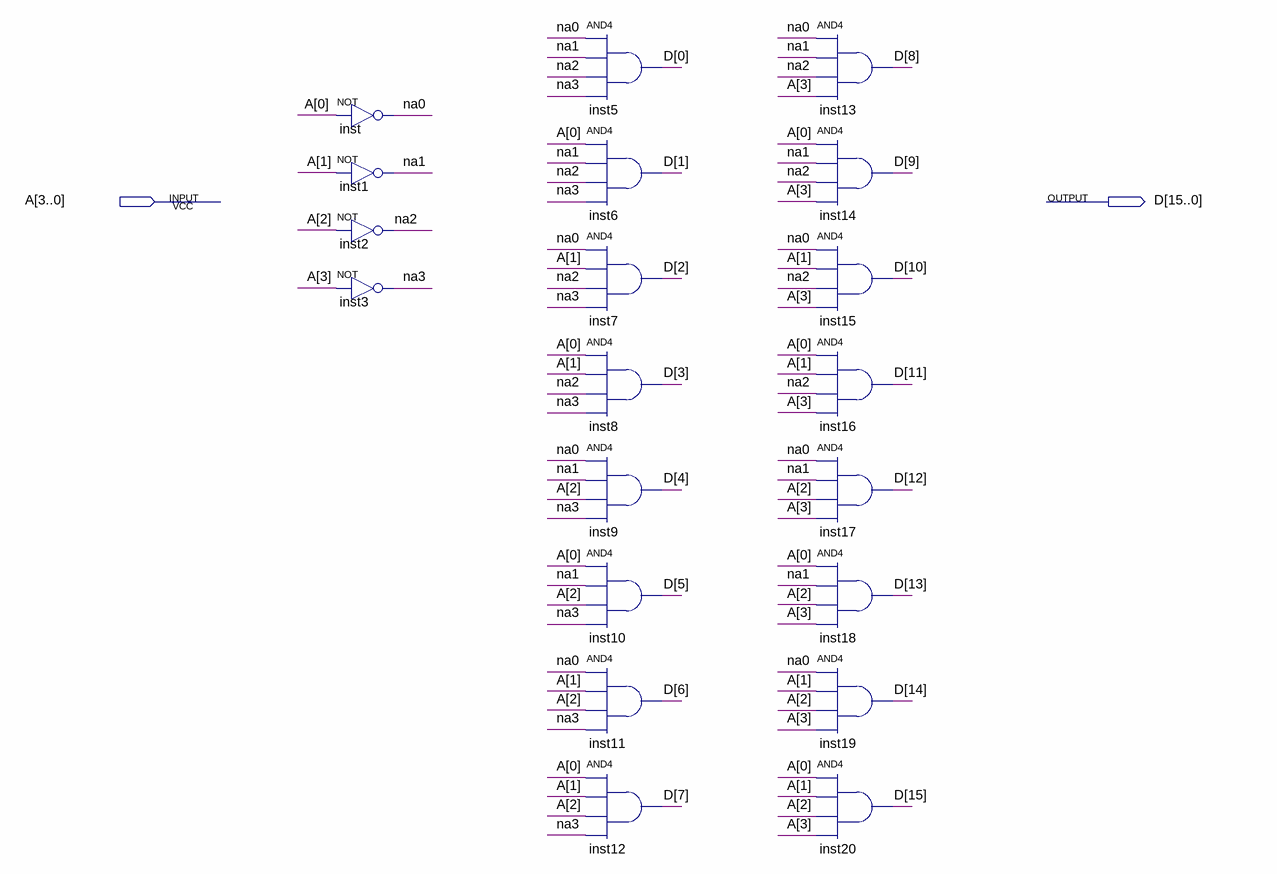
[diagram p0: schematic sheet]
// Quartus schematic DECOD416.bdf as structural Verilog: 20 symbols, 2 pins
module DECOD416 (
  input  [3:0] A,
  output [15:0] D
);

  wire na0, na1, na2, na3;

  not inst (na0, A[0]);
  not inst1 (na1, A[1]);
  not inst2 (na2, A[2]);
  not inst3 (na3, A[3]);
  and inst5 (D[0], na0, na1, na2, na3);
  and inst6 (D[1], A[0], na1, na2, na3);
  and inst7 (D[2], na0, A[1], na2, na3);
  and inst8 (D[3], A[0], A[1], na2, na3);
  and inst9 (D[4], na0, na1, A[2], na3);
  and inst10 (D[5], A[0], na1, A[2], na3);
  and inst11 (D[6], na0, A[1], A[2], na3);
  and inst12 (D[7], A[0], A[1], A[2], na3);
  and inst13 (D[8], na0, na1, na2, A[3]);
  and inst14 (D[9], A[0], na1, na2, A[3]);
  and inst15 (D[10], na0, A[1], na2, A[3]);
  and inst16 (D[11], A[0], A[1], na2, A[3]);
  and inst17 (D[12], na0, na1, A[2], A[3]);
  and inst18 (D[13], A[0], na1, A[2], A[3]);
  and inst19 (D[14], na0, A[1], A[2], A[3]);
  and inst20 (D[15], A[0], A[1], A[2], A[3]);
endmodule
